# Altium schematic sheet WIFI.SchDoc
size A4
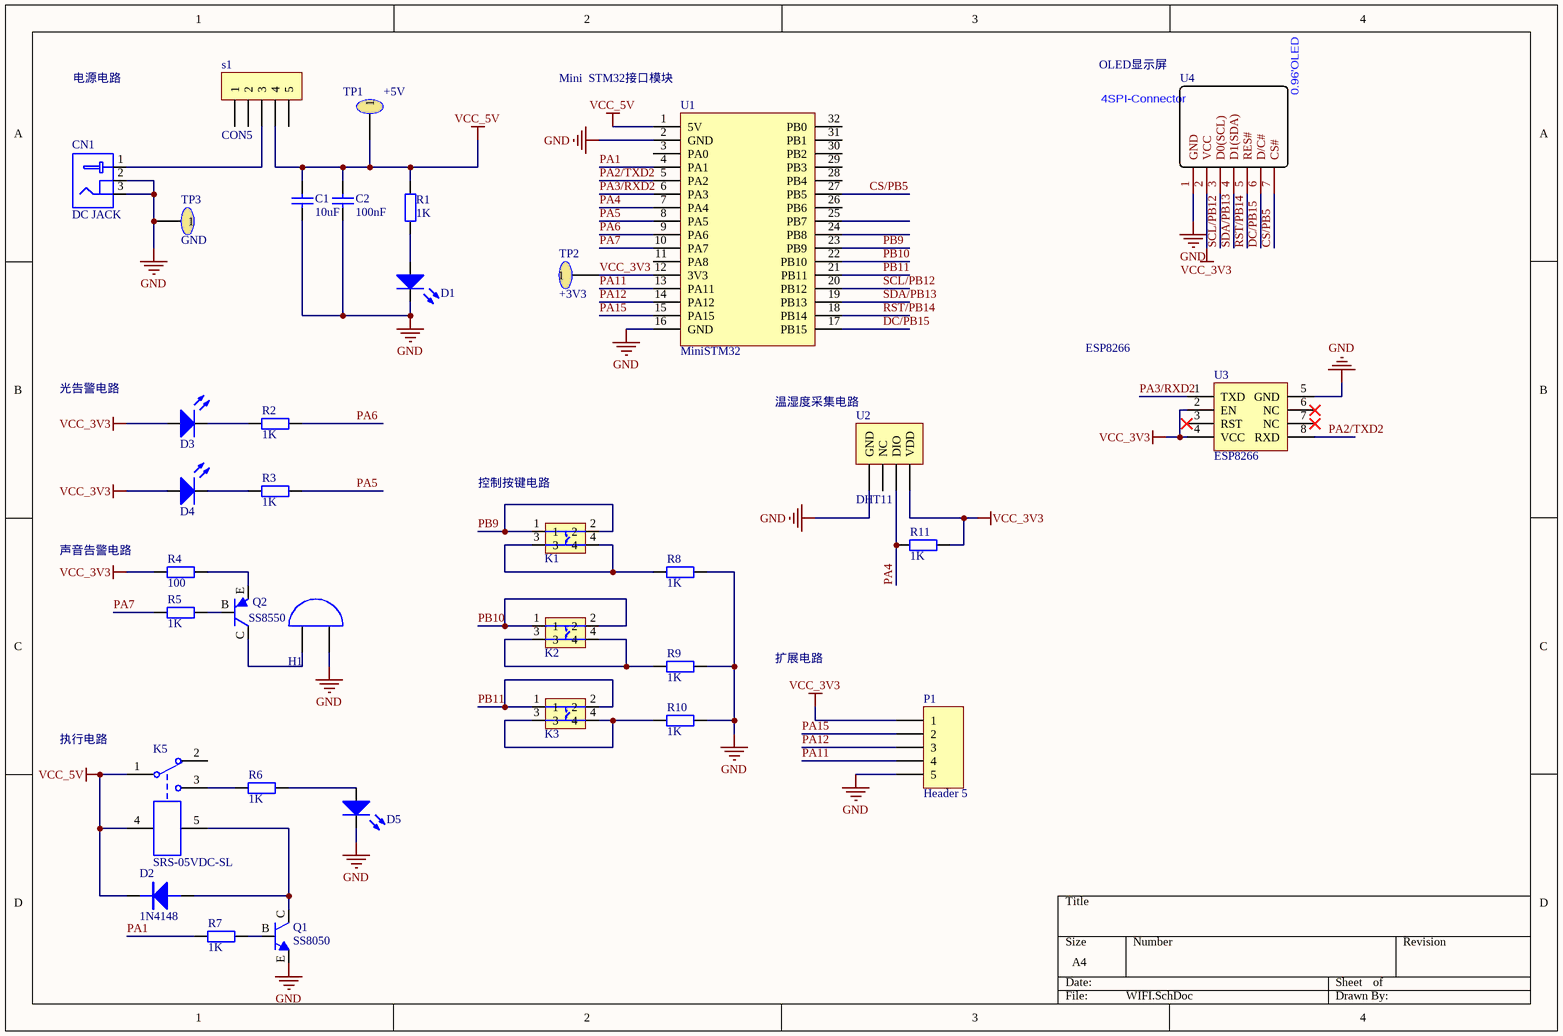
[diagram p0: WIFI.SchDoc]

## Parts
C1  10uF  [0805贴片电容]
C2  100nF  [0805贴片电容]
CN1  DC JACK  [DC JACK]
D1  0805 LED  [0805 LED]  (value not drawn)
D2  1N4148  [LL34圆柱]
D3  0805 LED  [0805 LED]  (value not drawn)
D4  0805 LED  [0805 LED]  (value not drawn)
D5  0805 LED  [0805 LED]  (value not drawn)
H1  蜂鸣器  [buzzer]  (value not drawn)
K1  SW6X6轻触开关_1  [SW6X6轻触开关]  (value not drawn)
K2  SW6X6轻触开关_1  [SW6X6轻触开关]  (value not drawn)
K3  SW6X6轻触开关_1  [SW6X6轻触开关]  (value not drawn)
K5  SRS-05VDC-SL  [继电器]
P1  Header 5  [HDR1X5]
Q1  SS8050  [插件三极管TO-92]
Q2  SS8550  [插件三极管TO-92]
R1  1K  [0805贴片电阻]
R2  1K  [0805贴片电阻]
R3  1K  [0805贴片电阻]
R4  100  [0805贴片电阻]
R5  1K  [0805贴片电阻]
R6  1K  [0805贴片电阻]
R7  1K  [0805贴片电阻]
R8  1K  [0805贴片电阻]
R9  1K  [0805贴片电阻]
R10  1K  [0805贴片电阻]
R11  1K  [0805贴片电阻]
s1  CON5  [拨动开关5脚]
TP1  +5V  [单过孔（有外框）]
TP2  +3V3  [单过孔（有外框）]
TP3  GND  [单过孔（有外框）]
U1  MiniSTM32  [Mini STM32(19.5mm)]
U2  DHT11  [DHT11（卧倒）]
U3  ESP8266  [ESP8266(有边框)]
U4  0.96寸OLED(7脚)  [0.96寸OLED7脚]  (value not drawn)

## Nets
GND: C1.1 C2.1 CN1.2 CN1.3 D1.2(K) D5.2(K) H1.2 P1.5 Q1.E R8.2 R9.2 R10.2 TP3.1 U1.2(GND) U1.16(GND) U2.4(GND) U3.5(GND) U4.1(GND)
VCC_3V3: D3.1(A) D4.1(A) P1.1 R4.1 R11.2 TP2.1 U1.12(3V3) U2.1(VDD) U3.2(EN) U3.4(VCC) U4.2(VCC)
VCC_5V: C1.2 C2.2 D2.2(K) K5.1 K5.4 R1.2 s1.4 TP1.1 U1.1(5V)
CS/PB5: U1.27(PB5) U4.7(CS#)
DC/PB15: U1.17(PB15) U4.6(D/C#)
PA1: R7.1 U1.4(PA1)
PA2/TXD2: U1.5(PA2) U3.8(RXD)
PA3/RXD2: U1.6(PA3) U3.1(TXD)
PA4: R11.1 U1.7(PA4) U2.2(DIO)
PA5: R3.2 U1.8(PA5)
PA6: R2.2 U1.9(PA6)
PA7: R5.1 U1.10(PA7)
PA11: P1.4 U1.13(PA11)
PA12: P1.3 U1.14(PA12)
PA15: P1.2 U1.15(PA15)
PB9: K1.1 K1.2 U1.23(PB9)
PB10: K2.1 K2.2 U1.22(PB10)
PB11: K3.1 K3.2 U1.21(PB11)
RST/PB14: U1.18(PB14) U4.5(RES#)
SCL/PB12: U1.20(PB12) U4.3(D0(SCL))
SDA/PB13: U1.19(PB13) U4.4(D1(SDA))
NetCN1_1: CN1.1 s1.3
NetD1_1: D1.1(A) R1.1
NetD2_1: D2.1(A) K5.5 Q1.C
NetD3_2: D3.2(K) R2.1
NetD4_2: D4.2(K) R3.1
NetD5_1: D5.1(A) R6.2
NetH1_1: H1.1 Q2.C
NetK1_3: K1.3 K1.4 R8.1
NetK2_3: K2.3 K2.4 R9.1
NetK3_3: K3.3 K3.4 R10.1
NetK5_3: K5.3 R6.1
NetQ1_B: Q1.B R7.2
NetQ2_B: Q2.B R5.2
NetQ2_E: Q2.E R4.2

Not connected (* = marked no-connect by the designer): K5 2; s1 1 2 5; U1 3(PA0) 11(PA8) 24(PB8) 25(PB7) 26(PB6) 28(PB4) 29(PB3) 30(PB2) 31(PB1) 32(PB0); U2 3(NC); U3 3(RST)* 6(NC)* 7(NC)*

## Notes on the sheet
- 电源电路
- (near U1) Mini  STM32接口模块
- OLED显示屏
- ESP8266
- 光告警电路
- 温湿度采集电路
- (near K1) 控制按键电路
- 声音告警电路
- 扩展电路
- 执行电路
- (in symbol 0.96寸OLED(7脚)) 4SPI-Connector; 0.96'OLED

## Library data of the parts
C1 C2 = 0805贴片电容: 100nF,0805,±10%
CN1 = DC JACK: DC JACK电源插座,5.5mm孔径,3脚接插件
D1 D3-D5 = 0805 LED: 发光二极管,绿光,0805
D2 = 1N4148圆柱: 1N4148圆柱形
H1 = BELL: TMB-12-A05,电磁式,2脚直插,直径12mm,脚间距6.8mm
K1-K3 = SW6X6轻触开关_1: 6*6mm*4.5mm轻触开关,4脚插件,180°
K5 = 继电器: SRS-05VDC-SL,6脚插件,单刀双掷
P1 = Header 5: Header, 5-Pin; LatestRevisionDate: 17-Jul-2002; LatestRevisionNote: Re-released for DXP Platform.; Publisher: Altium Limited
Q1 = 插件NPN三极管: SS8050,直插NPN三极管,TO-92封装
Q2 = 插件PNP三极管: SS8550,直插PNP三极管,TO-92封装
R1-R11 = 0805贴片电阻: 1KΩ,0805,±5%
s1 = 拨动开关5脚: 12*6mm,SS12F44G5 #KG44,5-pin,3mm间距,滑竿高度10mm,单刀双掷开关
TP1-TP3 = 测试点
U1 = MiniSTM32（19.5mm）
U3 = ESP8266: 双排直插座,2*4-pin,2.54mm间距,180°
U4 = 0.96寸OLED(7脚): 单排直插座,1*7-pin,2.54mm间距,180°